# Altium schematic sheet oscilostor.SchDoc
size A2; Organization: Altium Limited; Address1: L3, 12a Rodborough Rd; Address2: Frenchs Forest; Address3: NSW; Address4: Australia 2086
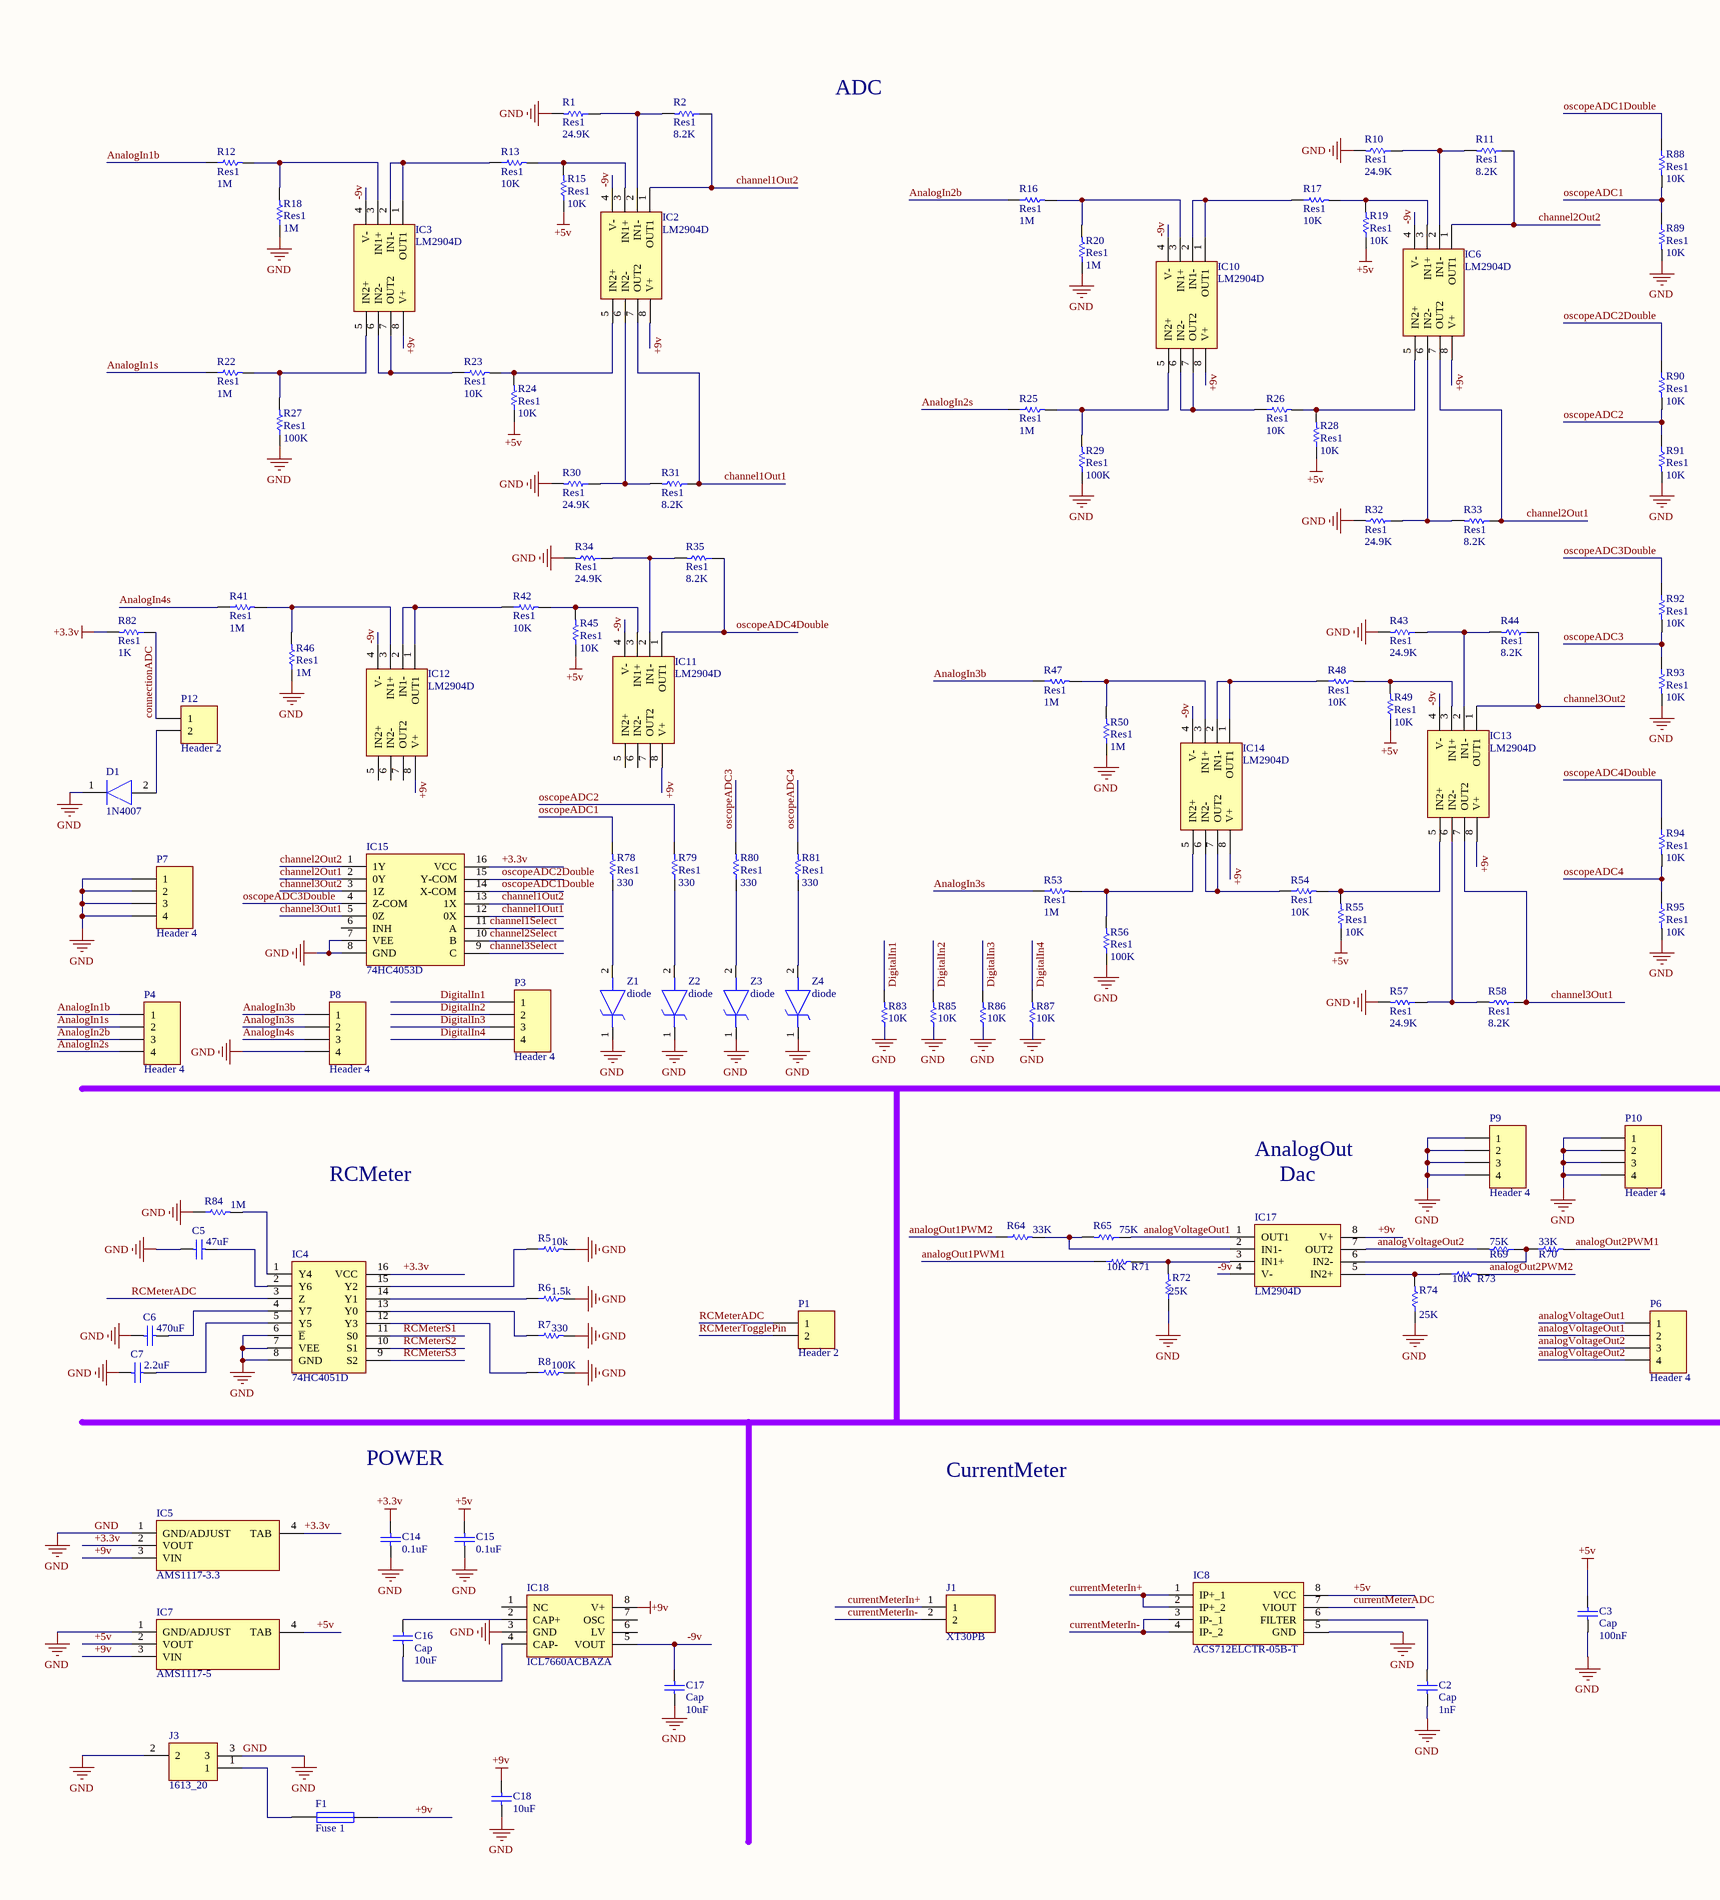
[diagram p0: oscilostor.SchDoc, left]
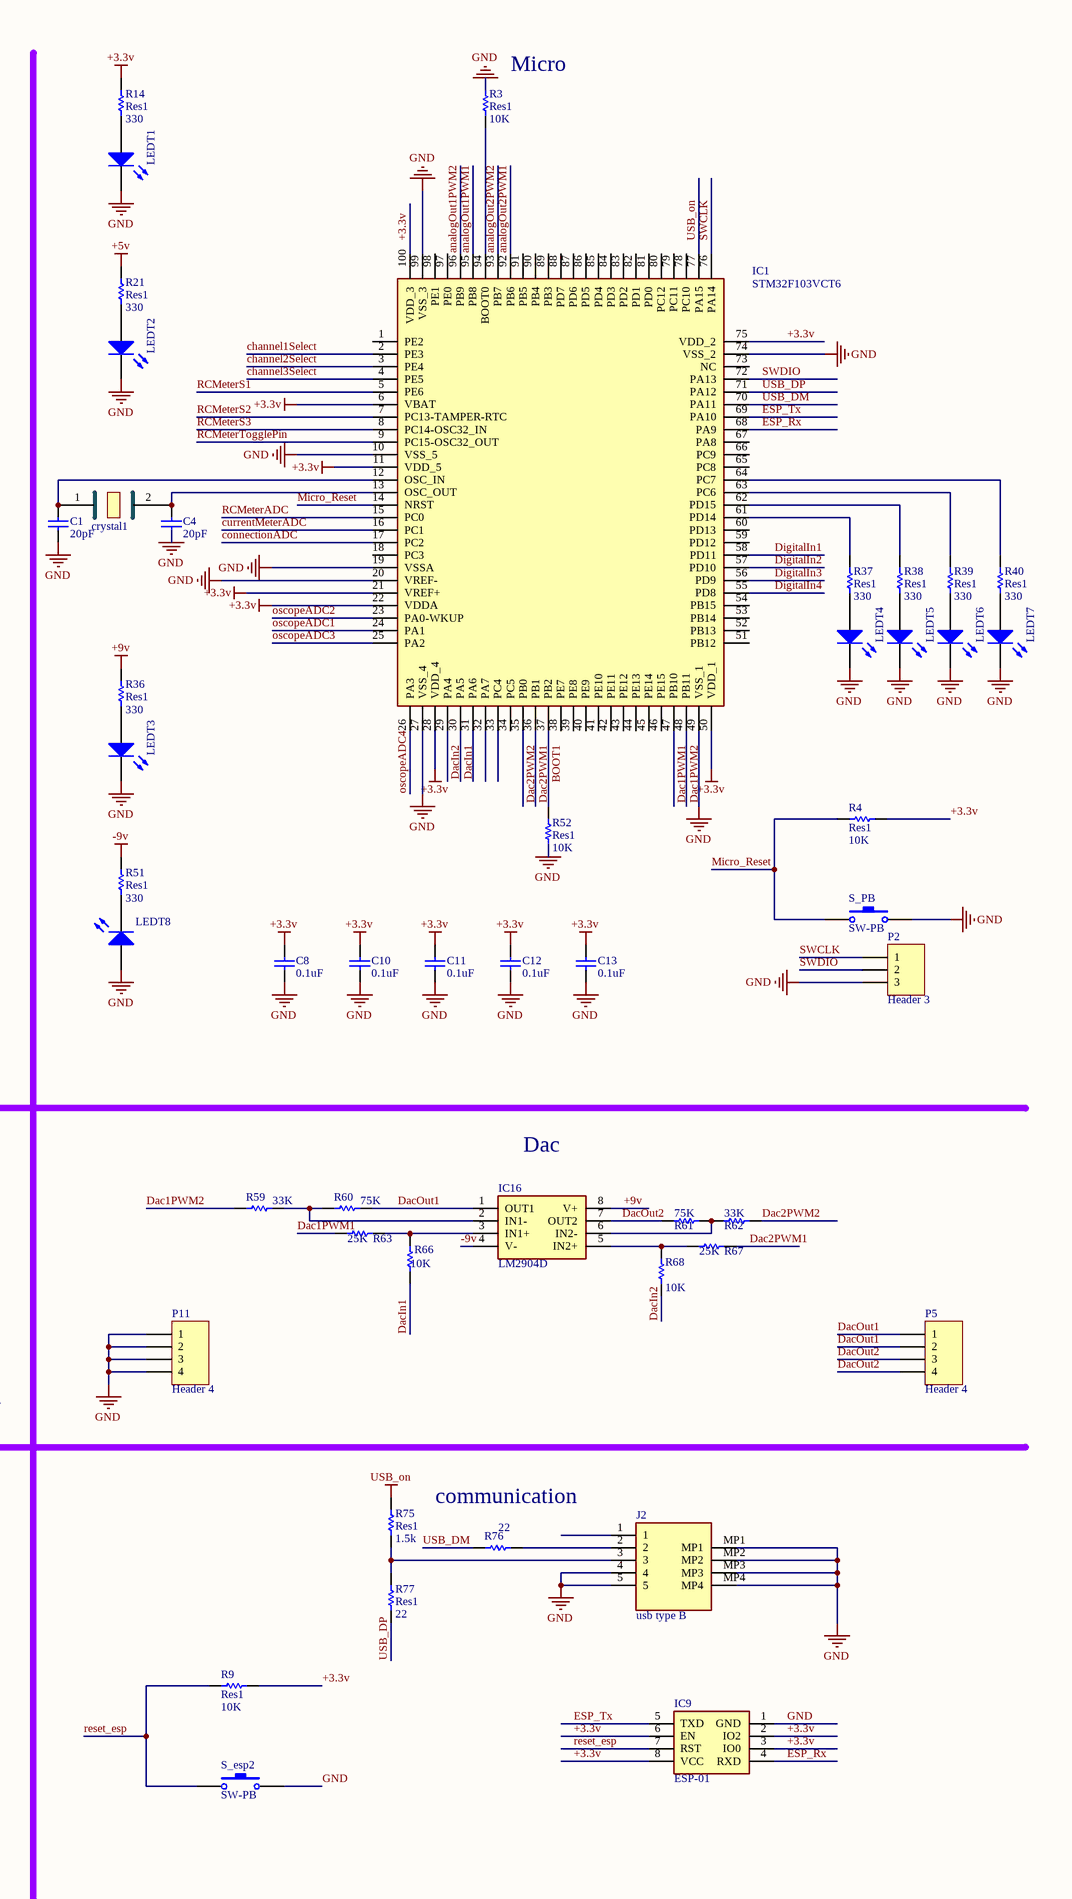
[diagram p1: oscilostor.SchDoc, right]

## Parts
C1  value 20pF  [J1-0603]  (hidden comment: C0603)
C2  Cap  value 1nF  [J1-0603]
C3  Cap  value 100nF  [J1-0603]
C4  value 20pF  [J1-0603]  (hidden comment: C0603)
C5  value 47uF  [Deep Cap gerdaloo]  (hidden comment: Cap)
C6  value 470uF  [Deep Cap gerdaloo]  (hidden comment: Cap)
C7  value 2.2uF  [Deep Cap gerdaloo]  (hidden comment: Cap)
C8  value 0.1uF  [J1-0603]  (hidden comment: C0603)
C10  value 0.1uF  [J1-0603]  (hidden comment: C0603)
C11  value 0.1uF  [J1-0603]  (hidden comment: C0603)
C12  value 0.1uF  [J1-0603]  (hidden comment: C0603)
C13  value 0.1uF  [J1-0603]  (hidden comment: C0603)
C14  value 0.1uF  [J1-0603]  (hidden comment: C0603)
C15  value 0.1uF  [J1-0603]  (hidden comment: C0603)
C16  Cap  value 10uF  [J1-0603]
C17  Cap  value 10uF  [J1-0603]
C18  value 10uF  [J1-0603]  (hidden comment: C0603)
crystal1  clockProducerDeep  [smd CRYSTAL]  (value not drawn)
D1  1N4007  [DIOM5327X242N]
F1  Fuse 1  [0805]
IC1  STM32F103VCT6  [QFP50P1600X1600X160-100N]
IC2  LM2904D  [SOIC127P600X175-8N]
IC3  LM2904D  [SOIC127P600X175-8N]
IC4  74HC4051D  [SOIC127P600X175-16N]
IC5  AMS1117-3.3  [SOT229P700X180-4N]
IC6  LM2904D  [SOIC127P600X175-8N]
IC7  AMS1117-5  [SOT229P700X180-4N]
IC8  ACS712ELCTR-05B-T  [SOIC127P600X175-8N]
IC9  ESP-01  [HDR2X4]
IC10  LM2904D  [SOIC127P600X175-8N]
IC11  LM2904D  [SOIC127P600X175-8N]
IC12  LM2904D  [SOIC127P600X175-8N]
IC13  LM2904D  [SOIC127P600X175-8N]
IC14  LM2904D  [SOIC127P600X175-8N]
IC15  74HC4053D  [SOIC127P600X175-16N]
IC16  LM2904D  [SOIC127P600X175-8N]
IC17  LM2904D  [SOIC127P600X175-8N]
IC18  ICL7660ACBAZA  [SOIC127P600X175-8N]
J1  XT30PB  [XT30PB]
J2  usb type B  [0474910001]
J3  1613_20  [161320]
LEDT1  (no value)  [3518]
LEDT2  (no value)  [3518]
LEDT3  (no value)  [3518]
LEDT4  (no value)  [3518]
LEDT5  (no value)  [3518]
LEDT6  (no value)  [3518]
LEDT7  (no value)  [3518]
LEDT8  (no value)  [3518]
P1  Header 2  [HDR1X2]
P2  Header 3  [HDR1X3]
P3  Header 4  [HDR1X4]
P4  Header 4  [HDR1X4]
P5  Header 4  [HDR1X4]
P6  Header 4  [HDR1X4]
P7  Header 4  [HDR1X4]
P8  Header 4  [HDR1X4]
P9  Header 4  [HDR1X4]
P10  Header 4  [HDR1X4]
P11  Header 4  [HDR1X4]
P12  Header 2  [HDR1X2]
R1  Res1  value 24.9K  [J1-0603]
R2  Res1  value 8.2K  [J1-0603]
R3  Res1  value 10K  [J1-0603]
R4  Res1  value 10K  [J1-0603]
R5  value 10k  [J1-0603]  (hidden comment: Res1)
R6  value 1.5k  [J1-0603]  (hidden comment: Res1)
R7  value 330  [J1-0603]  (hidden comment: Res1)
R8  value 100K  [J1-0603]  (hidden comment: Res1)
R9  Res1  value 10K  [J1-0603]
R10  Res1  value 24.9K  [J1-0603]
R11  Res1  value 8.2K  [J1-0603]
R12  Res1  value 1M  [J1-0603]
R13  Res1  value 10K  [J1-0603]
R14  Res1  value 330  [j1-0603]
R15  Res1  value 10K  [J1-0603]
R16  Res1  value 1M  [J1-0603]
R17  Res1  value 10K  [J1-0603]
R18  Res1  value 1M  [J1-0603]
R19  Res1  value 10K  [J1-0603]
R20  Res1  value 1M  [J1-0603]
R21  Res1  value 330  [j1-0603]
R22  Res1  value 1M  [J1-0603]
R23  Res1  value 10K  [J1-0603]
R24  Res1  value 10K  [J1-0603]
R25  Res1  value 1M  [J1-0603]
R26  Res1  value 10K  [J1-0603]
R27  Res1  value 100K  [J1-0603]
R28  Res1  value 10K  [J1-0603]
R29  Res1  value 100K  [J1-0603]
R30  Res1  value 24.9K  [J1-0603]
R31  Res1  value 8.2K  [J1-0603]
R32  Res1  value 24.9K  [J1-0603]
R33  Res1  value 8.2K  [J1-0603]
R34  Res1  value 24.9K  [J1-0603]
R35  Res1  value 8.2K  [J1-0603]
R36  Res1  value 330  [j1-0603]
R37  Res1  value 330  [j1-0603]
R38  Res1  value 330  [j1-0603]
R39  Res1  value 330  [j1-0603]
R40  Res1  value 330  [j1-0603]
R41  Res1  value 1M  [J1-0603]
R42  Res1  value 10K  [J1-0603]
R43  Res1  value 24.9K  [J1-0603]
R44  Res1  value 8.2K  [J1-0603]
R45  Res1  value 10K  [J1-0603]
R46  Res1  value 1M  [J1-0603]
R47  Res1  value 1M  [J1-0603]
R48  Res1  value 10K  [J1-0603]
R49  Res1  value 10K  [J1-0603]
R50  Res1  value 1M  [J1-0603]
R51  Res1  value 330  [j1-0603]
R52  Res1  value 10K  [J1-0603]
R53  Res1  value 1M  [J1-0603]
R54  Res1  value 10K  [J1-0603]
R55  Res1  value 10K  [J1-0603]
R56  Res1  value 100K  [J1-0603]
R57  Res1  value 24.9K  [J1-0603]
R58  Res1  value 8.2K  [J1-0603]
R59  value 33K  [J1-0603]  (hidden comment: Res1)
R60  value 75K  [J1-0603]  (hidden comment: Res1)
R61  value 75K  [J1-0603]  (hidden comment: Res1)
R62  value 33K  [J1-0603]  (hidden comment: Res1)
R63  value 25K  [J1-0603]  (hidden comment: Res1)
R64  value 33K  [J1-0603]  (hidden comment: Res1)
R65  value 75K  [J1-0603]  (hidden comment: Res1)
R66  value 10K  [J1-0603]  (hidden comment: Res1)
R67  value 25K  [J1-0603]  (hidden comment: Res1)
R68  value 10K  [J1-0603]  (hidden comment: Res1)
R69  value 75K  [J1-0603]  (hidden comment: Res1)
R70  value 33K  [J1-0603]  (hidden comment: Res1)
R71  value 10K  [J1-0603]  (hidden comment: Res1)
R72  value 25K  [J1-0603]  (hidden comment: Res1)
R73  value 10K  [J1-0603]  (hidden comment: Res1)
R74  value 25K  [J1-0603]  (hidden comment: Res1)
R75  Res1  value 1.5k  [J1-0603]
R76  value 22  [J1-0603]  (hidden comment: Res1)
R77  Res1  value 22  [J1-0603]
R78  Res1  value 330  [J1-0603]
R79  Res1  value 330  [J1-0603]
R80  Res1  value 330  [J1-0603]
R81  Res1  value 330  [J1-0603]
R82  Res1  value 1K  [J1-0603]
R83  value 10K  [J1-0603]  (hidden comment: Res1)
R84  value 1M  [J1-0603]  (hidden comment: Res1)
R85  value 10K  [J1-0603]  (hidden comment: Res1)
R86  value 10K  [J1-0603]  (hidden comment: Res1)
R87  value 10K  [J1-0603]  (hidden comment: Res1)
R88  Res1  value 10K  [J1-0603]
R89  Res1  value 10K  [J1-0603]
R90  Res1  value 10K  [J1-0603]
R91  Res1  value 10K  [J1-0603]
R92  Res1  value 10K  [J1-0603]
R93  Res1  value 10K  [J1-0603]
R94  Res1  value 10K  [J1-0603]
R95  Res1  value 10K  [J1-0603]
S_esp2  SW-PB  [button]
S_PB  SW-PB  [button]
Z1  diode  [TZMC4V7GS08]
Z2  diode  [TZMC4V7GS08]
Z3  diode  [TZMC4V7GS08]
Z4  diode  [TZMC4V7GS08]

## Nets
+3.3v: C8.1 C10.1 C11.1 C12.1 C13.1 C14.1 IC1.6(VBAT) IC1.11(VDD_5) IC1.21(VREF+) IC1.22(VDDA) IC1.28(VDD_4) IC1.50(VDD_1) IC1.75(VDD_2) IC1.100(VDD_3) IC4.16(VCC) IC5.2(VOUT) IC5.4(TAB) IC9.2(IO2) IC9.3(IO0) IC9.6(EN) IC9.8(VCC) IC15.16(VCC) R4.2 R9.2 R14.1 R82.2
+5v: C3.2 C15.1 IC7.2(VOUT) IC7.4(TAB) IC8.8(VCC) R15.1 R19.1 R21.1 R24.1 R28.1 R45.1 R49.1 R55.1
+9v: C18.1 F1.2 IC2.8(V+) IC3.8(V+) IC5.3(VIN) IC6.8(V+) IC7.3(VIN) IC10.8(V+) IC11.8(V+) IC12.8(V+) IC13.8(V+) IC14.8(V+) IC16.8(V+) IC17.8(V+) IC18.8(V+) R36.1
-9v: C17.2 IC2.4(V-) IC3.4(V-) IC6.4(V-) IC10.4(V-) IC11.4(V-) IC12.4(V-) IC13.4(V-) IC14.4(V-) IC16.4(V-) IC17.4(V-) IC18.5(VOUT) R51.1
GND: C1.1 C2.1 C3.1 C4.1 C5.1 C6.1 C7.1 C8.2 C10.2 C11.2 C12.2 C13.2 C14.2 C15.2 C17.1 C18.2 D1.1(K) IC1.10(VSS_5) IC1.19(VSSA) IC1.20(VREF-) IC1.27(VSS_4) IC1.49(VSS_1) IC1.74(VSS_2) IC1.99(VSS_3) IC4.6(~{E}) IC4.7(VEE) IC4.8(GND) IC5.1(GND/ADJUST) IC7.1(GND/ADJUST) IC8.5(GND) IC9.1(GND) IC15.7(VEE) IC15.8(GND) IC18.3(GND) J2.4 J2.5 J2.MP1 J2.MP2 J2.MP3 J2.MP4 J3.2 J3.3 LEDT1.2(K) LEDT2.2(K) LEDT3.2(K) LEDT4.2(K) LEDT5.2(K) LEDT6.2(K) LEDT7.2(K) LEDT8.1(A) P2.3 P7.1 P7.2 P7.3 P7.4 P8.4 P9.1 P9.2 P9.3 P9.4 P10.1 P10.2 P10.3 P10.4 P11.1 P11.2 P11.3 P11.4 R1.2 R3.2 R5.2 R6.2 R7.2 R8.2 R10.2 R18.1 R20.1 R27.1 R29.1 R30.2 R32.2 R34.2 R43.2 R46.1 R50.1 R52.2 R56.1 R57.2 R72.1 R74.1 R83.1 R84.1 R85.1 R86.1 R87.1 R89.2 R91.2 R93.2 R95.2 S_esp2.2 S_PB.2 Z1.1(K) Z2.1(K) Z3.1(K) Z4.1(K)
USB_on: IC1.77(PA15) R75.2
AnalogIn1b: P4.1 R12.1
AnalogIn1s: P4.2 R22.1
AnalogIn2b: P4.3 R16.1
AnalogIn2s: P4.4 R25.1
AnalogIn3b: P8.1 R47.1
AnalogIn3s: P8.2 R53.1
AnalogIn4s: P8.3 R41.1
analogOut1PWM1: IC1.95(PB8) R71.1
analogOut1PWM2: IC1.96(PB9) R64.1
analogOut2PWM1: IC1.92(PB6) R70.2
analogOut2PWM2: IC1.93(PB7) R73.2
analogVoltageOut1: IC17.1(OUT1) P6.1 P6.2 R65.1
analogVoltageOut2: IC17.7(OUT2) P6.3 P6.4 R69.2
BOOT1: IC1.37(PB2) R52.1
channel1Out1: IC2.7(OUT2) IC15.12(0X) R31.1
channel1Out2: IC2.1(OUT1) IC15.13(1X) R2.1
channel1Select: IC1.2(PE3) IC15.11(A)
channel2Out1: IC6.7(OUT2) IC15.2(0Y) R33.1
channel2Out2: IC6.1(OUT1) IC15.1(1Y) R11.1
channel2Select: IC1.3(PE4) IC15.10(B)
channel3Out1: IC13.7(OUT2) IC15.5(0Z) R58.1
channel3Out2: IC13.1(OUT1) IC15.3(1Z) R44.1
channel3Select: IC1.4(PE5) IC15.9(C)
connectionADC: IC1.17(PC2) P12.1 R82.1
currentMeterADC: IC1.16(PC1) IC8.7(VIOUT)
currentMeterIn+: IC8.1(IP+_1) IC8.2(IP+_2) J1.1
currentMeterIn-: IC8.3(IP-_1) IC8.4(IP-_2) J1.2
Dac1PWM1: IC1.47(PB10) R63.1
Dac1PWM2: IC1.48(PB11) R59.1
Dac2PWM1: IC1.36(PB1) R67.2
Dac2PWM2: IC1.35(PB0) R62.2
DacIn1: IC1.30(PA5) R66.1
DacIn2: IC1.29(PA4) R68.1
DacOut1: IC16.1(OUT1) P5.1 P5.2 R60.1
DacOut2: IC16.7(OUT2) P5.3 P5.4 R61.2
DigitalIn1: IC1.58(PD11) P3.1 R83.2
DigitalIn2: IC1.57(PD10) P3.2 R85.2
DigitalIn3: IC1.56(PD9) P3.3 R86.2
DigitalIn4: IC1.55(PD8) P3.4 R87.2
ESP_Rx: IC1.68(PA9) IC9.4(RXD)
ESP_Tx: IC1.69(PA10) IC9.5(TXD)
Micro_Reset: IC1.14(NRST) R4.1 S_PB.1
oscopeADC1: IC1.24(PA1) R78.2 R88.2 R89.1
oscopeADC1Double: IC15.14(X-COM) R88.1
oscopeADC2: IC1.23(PA0-WKUP) R79.2 R90.2 R91.1
oscopeADC2Double: IC15.15(Y-COM) R90.1
oscopeADC3: IC1.25(PA2) R80.2 R92.2 R93.1
oscopeADC3Double: IC15.4(Z-COM) R92.1
oscopeADC4: IC1.26(PA3) R81.2 R94.2 R95.1
oscopeADC4Double: IC11.1(OUT1) R35.1 R94.1
RCMeterADC: IC1.15(PC0) IC4.3(Z) P1.1
RCMeterS1: IC1.5(PE6) IC4.11(S0)
RCMeterS2: IC1.7(PC13-TAMPER-RTC) IC4.10(S1)
RCMeterS3: IC1.8(PC14-OSC32_IN) IC4.9(S2)
RCMeterTogglePin: IC1.9(PC15-OSC32_OUT) P1.2
reset_esp: IC9.7(RST) R9.1 S_esp2.1
SWCLK: IC1.76(PA14) P2.1
SWDIO: IC1.72(PA13) P2.2
USB_DM: IC1.70(PA11) R76.2
USB_DP: IC1.71(PA12) R77.2
NetC1_2: C1.2 crystal1.1 IC1.12(OSC_IN)
NetC2_2: C2.2 IC8.6(FILTER)
NetC4_2: C4.2 crystal1.2 IC1.13(OSC_OUT)
NetC5_2: C5.2 IC4.2(Y6)
NetC6_2: C6.2 IC4.4(Y7)
NetC7_2: C7.2 IC4.5(Y5)
NetC16_1: C16.1 IC18.4(CAP-)
NetC16_2: C16.2 IC18.2(CAP+)
NetD1_2: D1.2(A) P12.2
NetF1_1: F1.1 J3.1
NetIC1_61: IC1.61(PD14) R37.1
NetIC1_62: IC1.62(PD15) R38.1
NetIC1_63: IC1.63(PC6) R39.1
NetIC1_64: IC1.64(PC7) R40.1
NetIC1_94: IC1.94(BOOT0) R3.1
NetIC2_2: IC2.2(IN1-) R1.1 R2.2
NetIC2_3: IC2.3(IN1+) R13.2 R15.2
NetIC2_5: IC2.5(IN2+) R23.2 R24.2
NetIC2_6: IC2.6(IN2-) R30.1 R31.2
NetIC3_1: IC3.1(OUT1) IC3.2(IN1-) R13.1
NetIC3_3: IC3.3(IN1+) R12.2 R18.2
NetIC3_5: IC3.5(IN2+) R22.2 R27.2
NetIC3_6: IC3.6(IN2-) IC3.7(OUT2) R23.1
NetIC4_1: IC4.1(Y4) R84.2
NetIC4_12: IC4.12(Y3) R8.1
NetIC4_13: IC4.13(Y0) R7.1
NetIC4_14: IC4.14(Y1) R6.1
NetIC4_15: IC4.15(Y2) R5.1
NetIC6_2: IC6.2(IN1-) R10.1 R11.2
NetIC6_3: IC6.3(IN1+) R17.2 R19.2
NetIC6_5: IC6.5(IN2+) R26.2 R28.2
NetIC6_6: IC6.6(IN2-) R32.1 R33.2
NetIC10_1: IC10.1(OUT1) IC10.2(IN1-) R17.1
NetIC10_3: IC10.3(IN1+) R16.2 R20.2
NetIC10_5: IC10.5(IN2+) R25.2 R29.2
NetIC10_6: IC10.6(IN2-) IC10.7(OUT2) R26.1
NetIC11_2: IC11.2(IN1-) R34.1 R35.2
NetIC11_3: IC11.3(IN1+) R42.2 R45.2
NetIC12_1: IC12.1(OUT1) IC12.2(IN1-) R42.1
NetIC12_3: IC12.3(IN1+) R41.2 R46.2
NetIC13_2: IC13.2(IN1-) R43.1 R44.2
NetIC13_3: IC13.3(IN1+) R48.2 R49.2
NetIC13_5: IC13.5(IN2+) R54.2 R55.2
NetIC13_6: IC13.6(IN2-) R57.1 R58.2
NetIC14_1: IC14.1(OUT1) IC14.2(IN1-) R48.1
NetIC14_3: IC14.3(IN1+) R47.2 R50.2
NetIC14_5: IC14.5(IN2+) R53.2 R56.2
NetIC14_6: IC14.6(IN2-) IC14.7(OUT2) R54.1
NetIC16_2: IC16.2(IN1-) R59.2 R60.2
NetIC16_3: IC16.3(IN1+) R63.2 R66.2
NetIC16_5: IC16.5(IN2+) R67.1 R68.2
NetIC16_6: IC16.6(IN2-) R61.1 R62.1
NetIC17_2: IC17.2(IN1-) R64.2 R65.2
NetIC17_3: IC17.3(IN1+) R71.2 R72.2
NetIC17_5: IC17.5(IN2+) R73.1 R74.2
NetIC17_6: IC17.6(IN2-) R69.1 R70.1
NetJ2_2: J2.2 R76.1
NetJ2_3: J2.3 R75.1 R77.1
NetLEDT1_1: LEDT1.1(A) R14.2
NetLEDT2_1: LEDT2.1(A) R21.2
NetLEDT3_1: LEDT3.1(A) R36.2
NetLEDT4_1: LEDT4.1(A) R37.2
NetLEDT5_1: LEDT5.1(A) R38.2
NetLEDT6_1: LEDT6.1(A) R39.2
NetLEDT7_1: LEDT7.1(A) R40.2
NetLEDT8_2: LEDT8.2(K) R51.2
NetR78_1: R78.1 Z1.2(A)
NetR79_1: R79.1 Z2.2(A)
NetR80_1: R80.1 Z3.2(A)
NetR81_1: R81.1 Z4.2(A)

Not connected (* = marked no-connect by the designer): IC1 1(PE2) 18(PC3) 31(PA6) 32(PA7) 33(PC4) 34(PC5) 38(PE7) 39(PE8) 40(PE9) 41(PE10) 42(PE11) 43(PE12) 44(PE13) 45(PE14) 46(PE15) 51(PB12) 52(PB13) 53(PB14) 54(PB15) 59(PD12) 60(PD13) 65(PC8) 66(PC9) 67(PA8) 73(NC) 78(PC10) 79(PC11) 80(PC12) 81(PD0) 82(PD1) 83(PD2) 84(PD3) 85(PD4) 86(PD5) 87(PD6) 88(PD7) 89(PB3) 90(PB4) 91(PB5) 97(PE0) 98(PE1); IC11 5(IN2+) 6(IN2-) 7(OUT2); IC12 5(IN2+) 6(IN2-) 7(OUT2); IC15 6(INH); IC18 1(NC) 6(LV) 7(OSC); J2 1

## Notes on the sheet
- ADC
- (near R3) Micro
- Dac
- RCMeter
- AnalogOut
- POWER
- CurrentMeter
- communication
- Title
- Size:
- Date:
- File:
- A2
- Number:
- Time:
- Revision:
- Sheet
- of

## Library data of the parts
C1 C4 C8 C10-C15 C18 = C0603: Ceramic Chip Capacitor - Standard; Note: Footprint corresponds to dimensions for bulk cassette packaging. This case size has tightened tolerances.; Published: 17-Jul-2002; LatestRevisionDate: 19-Mar-2004; LatestRevisionNote: Silkscreen size reduced.; DatasheetDocument: Mar-2001; PackageDocument: Mar-2001; PackageReference: 0603; Publisher: Altium Limited; Code_JEITA: 0603; Code_IPC: 1608 [0603]; ComponentLink1Description: Manufacturer Link; ComponentLink1URL: http://www.kemet.com/; ComponentLink2Description: Datasheet; ComponentLink2URL: http://www.kemet.com/kemet/web/homepage/kechome.nsf/vapubfilesname/F3102TA.pdf/$file/F3102TA.pdf
C2 C3 C5-C7 C16 C17 = Cap: Capacitor; Published: 8-Jun-2000; LatestRevisionDate: 17-Jul-2002; LatestRevisionNote: Re-released for DXP Platform.; PackageReference: RAD-0.3; Publisher: Altium Limited; PackageDescription: Radial Cap, Thru-Hole; 2 Leads; 0.3 in Pin Spacing
crystal1 = deep crystal
D1 = 1N4007: Diode; Manufacturer_Name: Shikues; Datasheet Link: https://datasheet.lcsc.com/szlcsc/SK-1N4007_C126233.pdf; Height: 2.42mm; Manufacturer_Part_Number: 1N4007
F1 = Fuse 1: Fuse; Published: 8-Jun-2000; LatestRevisionDate: 17-Jul-2002; LatestRevisionNote: Re-released for DXP Platform.; PackageReference: PIN-W2/E2.8; Publisher: Altium Limited; PackageDescription: Thru-Hole; 2 Leads
IC1 = STM32F103VCT6: Integrated Circuit; Manufacturer_Name: STMicroelectronics; Datasheet Link: https://www.st.com/resource/en/datasheet/stm32f103rc.pdf; Height: 1.6mm; Manufacturer_Part_Number: STM32F103VCT6; Mouser Part Number: 511-STM32F103VCT6; Mouser Price/Stock: https://www.mouser.co.uk/ProductDetail/STMicroelectronics/STM32F103VCT6?qs=%252BB84zevwoRDW1rpMEiZMCg%3D%3D; Arrow Part Number: STM32F103VCT6; Arrow Price/Stock: https://www.arrow.com/en/products/stm32f103vct6/stmicroelectronics
IC2 IC3 IC6 IC10-IC14 IC16 IC17 = LM2904D: Integrated Circuit; Manufacturer_Name: Texas Instruments; Datasheet Link: http://www.ti.com/lit/ds/symlink/lm2904.pdf; Height: 1.75mm; Manufacturer_Part_Number: LM2904D; Mouser Part Number: 595-LM2904D; Mouser Price/Stock: https://www.mouser.co.uk/ProductDetail/Texas-Instruments/LM2904D?qs=3pnr37ZAbK8kLA26cC%252BYEg%3D%3D; Arrow Part Number: LM2904D; Arrow Price/Stock: https://www.arrow.com/en/products/lm2904d/texas-instruments
IC4 = 74HC4051D: Integrated Circuit; Manufacturer_Name: Nexperia; Datasheet Link: https://assets.nexperia.com/documents/data-sheet/74HC_HCT4051.pdf; Height: 1.75mm; Manufacturer_Part_Number: 74HC4051D; Mouser Part Number: N/A; Mouser Price/Stock: https://www.mouser.com/Search/Refine.aspx?Keyword=N%2FA
IC5 IC7 = AMS1117-1.5: Integrated Circuit; Manufacturer_Name: ams; Datasheet Link: http://www.advanced-monolithic.com/pdf/ds1117.pdf; Height: 1.8mm; Manufacturer_Part_Number: AMS1117-1.5
IC8 = ACS712ELCTR-05B-T: Integrated Circuit; Manufacturer_Name: Sharp Microelectronics; Datasheet Link: https://www.allegromicro.com/~/media/Files/Datasheets/ACS712-Datasheet.ashx; Height: 1.75mm; Manufacturer_Part_Number: ACS712ELCTR-05B-T
IC9 = ESP-01: Integrated Circuit; pin to pad: 1>2 2>4 3>6 4>8 5>1 6>3 7>5 8>7; Manufacturer_Name: Ai-Thinker; Datasheet Link: http://wiki.ai-thinker.com/_media/esp8266/esp8266_series_modules_user_manual_v1.1.pdf; Height: 2mm; Manufacturer_Part_Number: ESP-01
IC15 = 74HC4053D: Integrated Circuit; Manufacturer_Name: Toshiba; Datasheet Link: http://toshiba.semicon-storage.com/info/docget.jsp?did=54976&prodName=74HC4053D; Height: 1.75mm; Manufacturer_Part_Number: 74HC4053D; Mouser Part Number: 757-74HC4053D; Mouser Price/Stock: https://www.mouser.co.uk/ProductDetail/Toshiba/74HC4053D/?qs=xhbEVWpZdWclq3MrSw2ZoQ%3D%3D
IC18 = ICL7660ACBAZA: Integrated Circuit; Manufacturer_Name: Renesas Electronics; Datasheet Link: https://www.renesas.com/en-us/www/doc/datasheet/icl7660s-a.pdf; Height: 1.75mm; Manufacturer_Part_Number: ICL7660ACBAZA; Mouser Part Number: 968-ICL7660ACBAZA; Mouser Price/Stock: https://www.mouser.co.uk/ProductDetail/Renesas-Intersil/ICL7660ACBAZA?qs=9fLuogzTs8LeW4me0pfrFQ%3D%3D
J1 = XT30PB: Connector; Manufacturer_Name: Amass; Datasheet Link: https://www.tme.eu/Document/4acc913878197f8c2e30d4b8cdc47230/XT30UPB%20SPEC.pdf; Height: 10.7mm; Manufacturer_Part_Number: XT30PB
J2 = 0474910001: Connector; Manufacturer_Name: Molex; Datasheet Link: https://www.molex.com/pdm_docs/sd/474910001_sd.pdf; Height: 2.94mm; Manufacturer_Part_Number: 0474910001; Arrow Part Number: 0474910001; Arrow Price/Stock: https://www.arrow.com/en/products/0474910001/molex
J3 = 1613_20: Connector; Manufacturer_Name: LUMBERG; Manufacturer_Part_Number: 1613 20; Datasheet Link: http://www.farnell.com/datasheets/2349122.pdf; Height: 7mm
LEDT1-LEDT8 = LED3: Typical BLUE SiC LED; pin to pad: 1>2 2>1; Published: 8-Jun-2000; LatestRevisionDate: 17-Dec-2003; LatestRevisionNote: PCB Footprint replaced.; DatasheetDocument: 16-Apr-2002; PackageDocument: 16-Apr-2002; PackageReference: 3.5X2.8X1.9; Publisher: Altium Limited
P1 P12 = Header 2: Header, 2-Pin; LatestRevisionDate: 17-Jul-2002; LatestRevisionNote: Re-released for DXP Platform.; Publisher: Altium Limited
P2 = Header 3: Header, 3-Pin; LatestRevisionDate: 17-Jul-2002; LatestRevisionNote: Re-released for DXP Platform.; Publisher: Altium Limited
P3-P11 = Header 4: Header, 4-Pin; LatestRevisionDate: 17-Jul-2002; LatestRevisionNote: Re-released for DXP Platform.; Publisher: Altium Limited
R1-R95 = Res1: Resistor; Published: 8-Jun-2000; LatestRevisionDate: 17-Jul-2002; LatestRevisionNote: Re-released for DXP Platform.; PackageReference: AXIAL-0.3; Publisher: Altium Limited
  R1-R13 R15-R20 R22-R35 R41-R50 R52-R95: PackageDescription: Axial Device, Thru-Hole; 2 Leads; 0.3 in Pin Spacing
S_esp2 S_PB = SW-PB: Switch; Published: 24-Mar-1999; LatestRevisionDate: 17-Jul-2002; LatestRevisionNote: Re-released for DXP Platform.; PackageReference: SPST-2; Publisher: Altium Limited
Z1-Z4 = TZMC4V7-GS08: Zener Diode; Manufacturer_Name: Vishay; Datasheet Link: https://www.vishay.com/docs/84122/tzm.pdf; Manufacturer_Part_Number: TZMC4V7-GS08; Mouser Part Number: 78-TZMC4.7; Mouser Price/Stock: https://www.mouser.com/Search/Refine.aspx?Keyword=78-TZMC4.7; Arrow Part Number: TZMC4V7-GS08; Arrow Price/Stock: https://www.arrow.com/en/products/tzmc4v7-gs08/vishay